# Altium schematic sheet PG03_Analog_Digital_Inputs.SchDoc
size A3
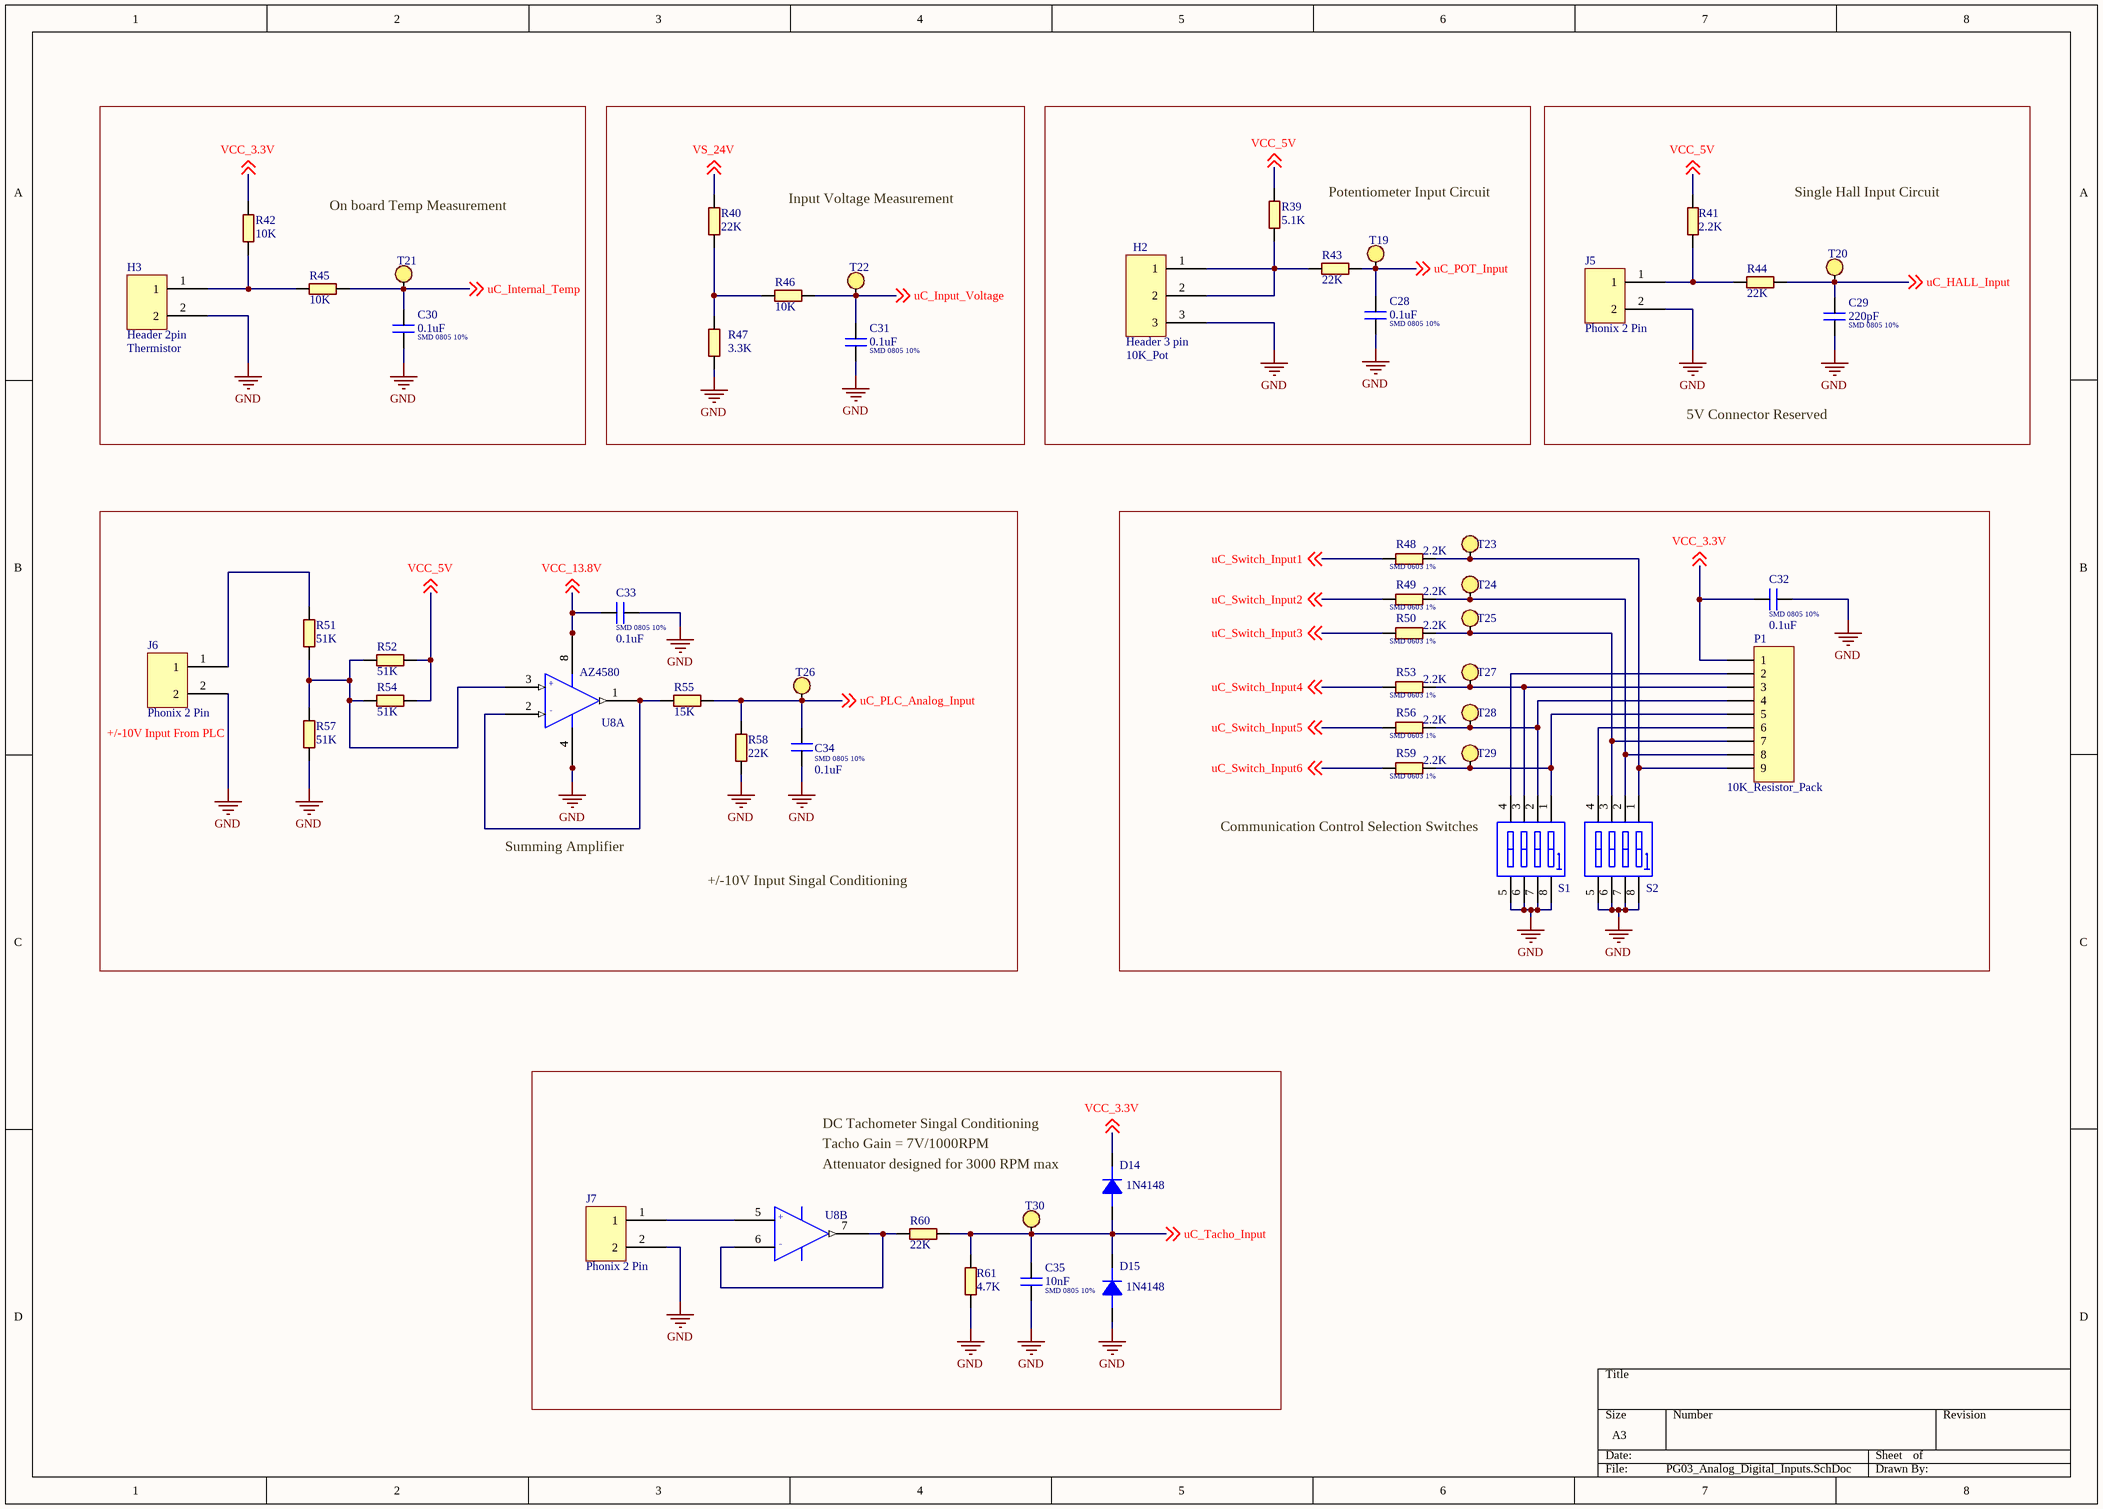
[diagram p0: PG03_Analog_Digital_Inputs.SchDoc]

## Parts
C28  SMD 0805 10%  value 0.1uF  [SMD0805]
C29  SMD 0805 10%  value 220pF  [SMD0805]
C30  SMD 0805 10%  value 0.1uF  [SMD0805]
C31  SMD 0805 10%  value 0.1uF  [SMD0805]
C32  SMD 0805 10%  value 0.1uF  [SMD0805]
C33  SMD 0805 10%  value 0.1uF  [SMD0805]
C34  SMD 0805 10%  value 0.1uF  [SMD0805]
C35  SMD 0805 10%  value 10nF  [SMD0805]
D14  1N4148  [SOD-80]
D15  1N4148  [SOD-80]
H2  10K_Pot  value Header 3 pin  [Header-3-Pin]
H3  Thermistor  value Header 2pin  [Header-2-Pin]
J5  Phonix 2 Pin  [PHONIX2]
J6  Phonix 2 Pin  [PHONIX2]
J7  Phonix 2 Pin  [PHONIX2]
P1  10K_Resistor_Pack  [HDR1X9]
R39  value 5.1K  [SMD1206]  (hidden comment: SMD 1206 1%)
R40  value 22K  [SMD1206]  (hidden comment: SMD 1206 1%)
R41  value 2.2K  [SMD1206]  (hidden comment: SMD 1206 1%)
R42  value 10K  [SMD1206]  (hidden comment: SMD 1206 1%)
R43  value 22K  [SMD1206]  (hidden comment: SMD 1206 1%)
R44  value 22K  [SMD1206]  (hidden comment: SMD 1206 1%)
R45  value 10K  [SMD1206]  (hidden comment: SMD 1206 1%)
R46  value 10K  [SMD1206]  (hidden comment: SMD 1206 1%)
R47  value 3.3K  [SMD1206]  (hidden comment: SMD 1206 1%)
R48  SMD 0603 1%  value 2.2K  [SMD0603]
R49  SMD 0603 1%  value 2.2K  [SMD0603]
R50  SMD 0603 1%  value 2.2K  [SMD0603]
R51  value 51K  [SMD1206]  (hidden comment: SMD 1206 1%)
R52  value 51K  [SMD1206]  (hidden comment: SMD 1206 1%)
R53  SMD 0603 1%  value 2.2K  [SMD0603]
R54  value 51K  [SMD1206]  (hidden comment: SMD 1206 1%)
R55  value 15K  [SMD1206]  (hidden comment: SMD 1206 1%)
R56  SMD 0603 1%  value 2.2K  [SMD0603]
R57  value 51K  [SMD1206]  (hidden comment: SMD 1206 1%)
R58  value 22K  [SMD1206]  (hidden comment: SMD 1206 1%)
R59  SMD 0603 1%  value 2.2K  [SMD0603]
R60  value 22K  [SMD1206]  (hidden comment: SMD 1206 1%)
R61  value 4.7K  [SMD1206]  (hidden comment: SMD 1206 1%)
S1  2.54mm DIP-4 SMD  [DIP8]  (value not drawn)
S2  2.54mm DIP-4 SMD  [DIP8]  (value not drawn)
T19  Through hole TestPoint  [TP]  (value not drawn)
T20  Through hole TestPoint  [TP]  (value not drawn)
T21  Through hole TestPoint  [TP]  (value not drawn)
T22  Through hole TestPoint  [TP]  (value not drawn)
T23  Through hole TestPoint  [TP]  (value not drawn)
T24  Through hole TestPoint  [TP]  (value not drawn)
T25  Through hole TestPoint  [TP]  (value not drawn)
T26  Through hole TestPoint  [TP]  (value not drawn)
T27  Through hole TestPoint  [TP]  (value not drawn)
T28  Through hole TestPoint  [TP]  (value not drawn)
T29  Through hole TestPoint  [TP]  (value not drawn)
T30  Through hole TestPoint  [TP]  (value not drawn)
U8  value AZ4580  [SOIC-8]  (hidden comment: LM358)  (parts A,B of 2)

## Blocks framed on the sheet
On board Temp Measurement: C30 H3 R42 R45 T21
Input Voltage Measurement: C31 R40 R46 R47 T22
Potentiometer Input Circuit: C28 H2 R39 R43 T19
Communication Control Selection Switches: C32 P1 R48-R50 R53 R56 R59 S1 S2 T23-T25 T27-T29

## Nets
GND: C28.2 C29.2 C30.2 C31.2 C32.2 C33.2 C34.1 C35.2 D15.1(ANODE) H2.3 H3.2 J5.2 J6.2 J7.2 R47.2 R57.1 R58.1 R61.2 S1.5(B4) S1.6(B3) S1.7(B2) S1.8(B1) S2.5(B4) S2.6(B3) S2.7(B2) S2.8(B1) U8.4(GND)
uC_HALL_Input: C29.1 R44.1 T20.1 ; off-sheet uC_HALL_Input
uC_Input_Voltage: C31.1 R46.1 T22.1 ; off-sheet uC_Input_Voltage
uC_Internal_Temp: C30.1 R45.1 T21.1 ; off-sheet uC_Internal_Temp
uC_PLC_Analog_Input: C34.2 R55.1 R58.2 T26.1 ; off-sheet uC_PLC_Analog_Input
uC_POT_Input: C28.1 R43.1 T19.1 ; off-sheet uC_POT_Input
uC_Switch_Input1: R48.1 ; off-sheet uC_Switch_Input1
uC_Switch_Input2: R49.1 ; off-sheet uC_Switch_Input2
uC_Switch_Input3: R50.1 ; off-sheet uC_Switch_Input3
uC_Switch_Input4: R53.1 ; off-sheet uC_Switch_Input4
uC_Switch_Input5: R56.1 ; off-sheet uC_Switch_Input5
uC_Switch_Input6: R59.1 ; off-sheet uC_Switch_Input6
uC_Tacho_Input: C35.1 D14.1(ANODE) D15.2(CATHODE) R60.1 R61.1 T30.1 ; off-sheet uC_Tacho_Input
VCC_3.3V: C32.1 D14.2(CATHODE) P1.1 R42.2 ; off-sheet VCC_3.3V
VCC_5V: R39.2 R41.1 R52.1 R54.1 ; off-sheet VCC_5V
VCC_13.8V: C33.1 U8.8(VCC) ; off-sheet VCC_13.8V
VS_24V: R40.2 ; off-sheet VS_24V
NetH2_1: H2.1 H2.2 R39.1 R43.2
NetH3_1: H3.1 R42.1 R45.2
NetJ5_1: J5.1 R41.2 R44.2
NetJ6_1: J6.1 R51.2
NetJ7_1: J7.1 U8.5(+IN)
NetP1_2: P1.2 S1.4(A4)
NetP1_3: P1.3 R53.2 S1.3(A3) T27.1
NetP1_4: P1.4 R56.2 S1.2(A2) T28.1
NetP1_5: P1.5 R59.2 S1.1(A1) T29.1
NetP1_6: P1.6 S2.4(A4)
NetP1_7: P1.7 R50.2 S2.3(A3) T25.1
NetP1_8: P1.8 R49.2 S2.2(A2) T24.1
NetP1_9: P1.9 R48.2 S2.1(A1) T23.1
NetR40_1: R40.1 R46.2 R47.1
NetR51_1: R51.1 R52.2 R54.2 R57.2 U8.3(+IN)
NetR55_2: R55.2 U8.1(OUT) U8.2(-IN)
NetR60_2: R60.2 U8.6(-IN) U8.7(OUT)

## Notes on the sheet
- Single Hall Input Circuit
- 5V Connector Reserved
- (near J6) +/-10V Input From PLC
- Summing Amplifier
- +/-10V Input Singal Conditioning
- DC Tachometer Singal Conditioning
- Tacho Gain = 7V/1000RPM
- (near D14) Attenuator designed for 3000 RPM max
- (in symbol LM358, part A) +; -
- (in symbol LM358, part B) +; -

## Library data of the parts
C28-C35 = CAP_SMD: Manufacturer: Vishay
D14 D15 = 1N4148: Part No.: SM4007; Manufacturer: Vishay; Source Of Supply: Rajiv Electronics,Pune; Type: Component; Temp. Range: -65 to 150 Deg. Cel.; Tolerance: 10%; Rating: -; Temp. Coeff.: -; Termination: -; Marking: -; Category: Diode
H2 = Header_3_Pin
H3 = Header_2_Pin: Manufaturer: Rajeev
J5-J7 = Phonix_2_Pin
P1 = Header 9: Header, 9-Pin; LatestRevisionDate: 17-Jul-2002; LatestRevisionNote: Re-released for DXP Platform.; Publisher: Altium Limited
R39-R61 = RES_SMD: Manufacturer: Vishay; Description: SMD1206  1% Resistor
S1 S2 = SW DIP-4: DIP Switch, 4 Position, SPST; Published: 24-Mar-1999; LatestRevisionDate: 17-Jul-2002; LatestRevisionNote: Re-released for DXP Platform.; PackageReference: SO8; Publisher: Altium Limited; Code_JEDEC: MS-012-AA; Code_IPC: SO8
T19-T30 = TestPoint_TH: Value: TP
U8 = LM358: Manufacturer: ST Semiconductor